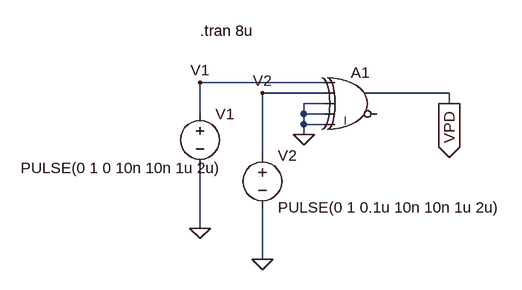
[diagram p0: schematic Phase detector simulation of an PLL.asc]
Phase detector simulation of an PLL.asc, the LTspice schematic file:
Version 4.1
SHEET 1 880 680
WIRE 160 96 -32 96
WIRE 160 112 64 112
WIRE 352 112 224 112
WIRE 160 128 128 128
WIRE 352 128 352 112
WIRE -32 144 -32 96
WIRE 128 144 128 128
WIRE 160 144 128 144
WIRE 128 160 128 144
WIRE 160 160 128 160
WIRE 128 176 128 160
WIRE 64 208 64 112
WIRE -32 320 -32 224
WIRE 64 368 64 288
FLAG -32 320 0
FLAG 64 368 0
FLAG 352 128 VPD
IOPIN 352 128 Out
FLAG -32 96 V1
FLAG 64 112 V2
FLAG 128 176 0
SYMBOL Digital\\xor 208 64 R0
SYMATTR InstName A1
SYMBOL voltage -32 128 R0
WINDOW 3 -276 99 Left 2
WINDOW 123 0 0 Left 0
WINDOW 39 0 0 Left 0
SYMATTR Value PULSE(0 1 0 10n 10n 1u 2u)
SYMATTR InstName V1
SYMBOL voltage 64 192 R0
WINDOW 123 0 0 Left 0
WINDOW 39 0 0 Left 0
SYMATTR InstName V2
SYMATTR Value PULSE(0 1 0.1u 10n 10n 1u 2u)
TEXT -32 16 Left 2 !.tran 8u

The netlist it stands for:
* Phase detector simulation of an PLL.asc
A1 V1 V2 0 0 0 0 VPD 0 XOR
V1 V1 0 PULSE(0 1 0 10n 10n 1u 2u)
V2 V2 0 PULSE(0 1 0.1u 10n 10n 1u 2u)
.tran 8u
.backanno
.end